# Altium schematic sheet KeyboardMoudle1.SchDoc
size A4
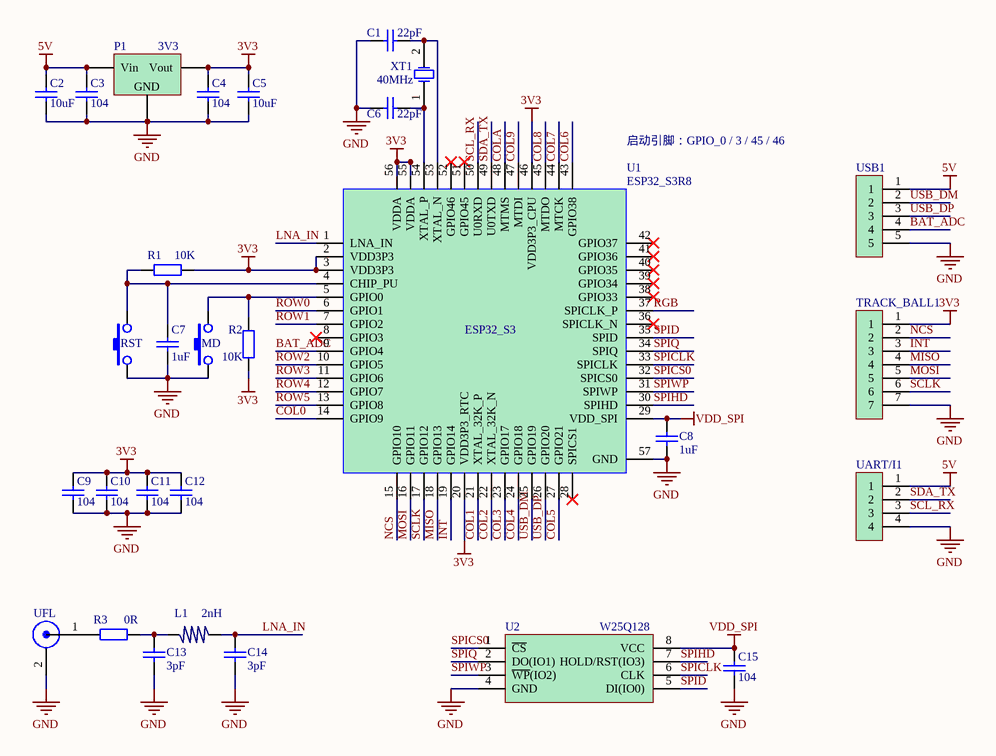
[diagram p0: KeyboardMoudle1.SchDoc]

## Parts
C1  22pF  [0603]
C2  10uF  [0603]
C3  104  [0603]
C4  104  [0603]
C5  10uF  [0603]
C6  22pF  [0603]
C7  1uF  [0603]
C8  1uF  [0603]
C9  104  [0603]
C10  104  [0603]
C11  104  [0603]
C12  104  [0603]
C13  3pF  [0603]
C14  3pF  [0603]
C15  104  [0603]
L1  2nH  [0603]
MD  KEY  [KEY_SMT_4_L]  (value not drawn)
P1  3V3  [SOT223]
R1  10K  [R_0603]
R2  10K  [R_0603]
R3  0R  [R_0603]
RST  KEY  [KEY_SMT_4_L]  (value not drawn)
TRACK_BALL1  SH1.25mm_7P  [SH1.25MM_7P]  (value not drawn)
U1  ESP32_S3R8  [QFN56]
U2  W25Q128  [SOIC8-208MIL]
UART/I1  SH1.25mm_4P  [SH1.25MM_4P]  (value not drawn)
UFL  UFL  [IPEX]  (value not drawn)
USB1  SH1.25mm_5P  [SH1.25MM_5P]  (value not drawn)
XT1  40MHz  [XTAL_5032]

## Nets
3V3: C4.2 C5.2 C9.2 C10.2 C11.2 C12.2 P1.2(Vout) R1.1 R2.1 TRACK_BALL1.1 U1.2(VDD3P3) U1.3(VDD3P3) U1.20(VDD3P3_RTC) U1.46(VDD3P3_CPU) U1.55(VDDA) U1.56(VDDA)
5V: C2.2 C3.2 P1.3(Vin) UART/I1.1 USB1.1
GND: C1.1 C2.1 C3.1 C4.1 C5.1 C6.2 C7.2 C8.2 C9.1 C10.1 C11.1 C12.1 C13.2 C14.2 C15.2 MD.1 P1.1(GND) RST.1 TRACK_BALL1.7 U1.57(GND) U2.4(GND) UART/I1.4 UFL.2 USB1.5
VDD_SPI: C8.1 C15.1 U1.29(VDD_SPI) U2.8(VCC)
BAT_ADC: U1.9(GPIO4) USB1.4
COL0: U1.14(GPIO9)
COL1: U1.21(XTAL_32K_P)
COL2: U1.22(XTAL_32K_N)
COL3: U1.23(GPIO17)
COL4: U1.24(GPIO18)
COL5: U1.27(GPIO21)
COL6: U1.43(GPIO38)
COL7: U1.44(MTCK)
COL8: U1.45(MTDO)
COL9: U1.47(MTDI)
COLA: U1.48(MTMS)
INT: TRACK_BALL1.3 U1.19(GPIO14)
LNA_IN: C14.1 L1.2 U1.1(LNA_IN)
MISO: TRACK_BALL1.4 U1.18(GPIO13)
MOSI: TRACK_BALL1.5 U1.16(GPIO11)
NCS: TRACK_BALL1.2 U1.15(GPIO10)
RGB: U1.37(SPICLK_P)
ROW0: U1.6(GPIO1)
ROW1: U1.7(GPIO2)
ROW2: U1.10(GPIO5)
ROW3: U1.11(GPIO6)
ROW4: U1.12(GPIO7)
ROW5: U1.13(GPIO8)
SCL_RX: U1.50(U0RXD) UART/I1.3
SCLK: TRACK_BALL1.6 U1.17(GPIO12)
SDA_TX: U1.49(U0TXD) UART/I1.2
SPICLK: U1.33(SPICLK) U2.6(CLK)
SPICS0: U1.32(SPICS0) U2.1(~{CS})
SPID: U1.35(SPID) U2.5(DI(IO0))
SPIHD: U1.30(SPIHD) U2.7(HOLD/RST(IO3))
SPIQ: U1.34(SPIQ) U2.2(DO(IO1))
SPIWP: U1.31(SPIWP) U2.3(~{WP}(IO2))
USB_DM: U1.25(GPIO19) USB1.2
USB_DP: U1.26(GPIO20) USB1.3
NetC1_2: C1.2 U1.53(XTAL_N) XT1.2(OSC2)
NetC6_1: C6.1 U1.54(XTAL_P) XT1.1(OSC1)
NetC7_1: C7.1 R1.2 RST.2 U1.4(CHIP_PU)
NetC13_1: C13.1 L1.1 R3.2
NetMD_2: MD.2 R2.2 U1.5(GPIO0)
NetR3_1: R3.1 UFL.1

Not connected (* = marked no-connect by the designer): U1 8(GPIO3)* 28(SPICS1)* 36(SPICLK_N)* 38(GPIO33)* 39(GPIO34)* 40(GPIO35)* 41(GPIO36)* 42(GPIO37)* 51(GPIO45)* 52(GPIO46)*

## Notes on the sheet
- (near U1) 启动引脚：GPIO_0 / 3 / 45 / 46

## Library data of the parts
C1-C15 = CAP_0603: 贴片电容 0603
L1 = L_0603: 电感 0603
MD RST = KEY_SMT_4_L: 卧式贴片按键 2*4*3.5mm
P1 = LDO_AMS1117: 线性稳压器
R1-R3 = RES_0603: 电阻 0603
U1 = ESP32_S3: ESP32
U2 = W25Q64: FLASH
UFL = UFL: 射频接口
XT1 = XTAL_5032: 贴片无源晶振